# Altium schematic sheet Adapter.SchDoc
size A4
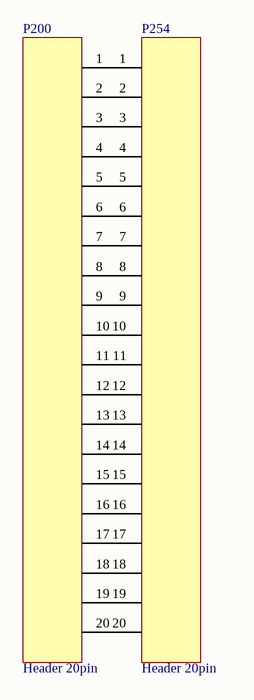
[diagram p0: Adapter.SchDoc]

## Parts
P200  Header 20pin  [Header 2.00 2x10]
P254  Header 20pin  [Header 2.54 2x10 rect pads]

## Nets
NetP200_1: P200.1 P254.1
NetP200_2: P200.2 P254.2
NetP200_3: P200.3 P254.3
NetP200_4: P200.4 P254.4
NetP200_5: P200.5 P254.5
NetP200_6: P200.6 P254.6
NetP200_7: P200.7 P254.7
NetP200_8: P200.8 P254.8
NetP200_9: P200.9 P254.9
NetP200_10: P200.10 P254.10
NetP200_11: P200.11 P254.11
NetP200_12: P200.12 P254.12
NetP200_13: P200.13 P254.13
NetP200_14: P200.14 P254.14
NetP200_15: P200.15 P254.15
NetP200_16: P200.16 P254.16
NetP200_17: P200.17 P254.17
NetP200_18: P200.18 P254.18
NetP200_19: P200.19 P254.19
NetP200_20: P200.20 P254.20